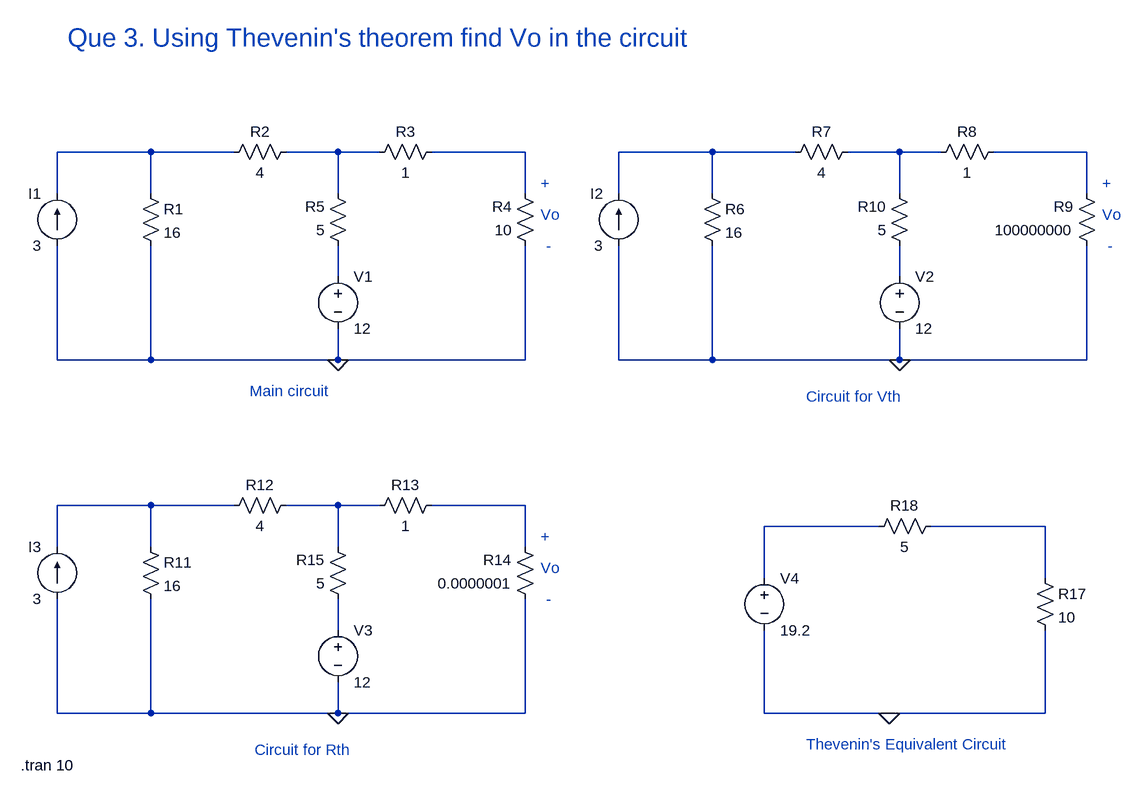
[diagram p0: schematic 3_Dheerendra_23EE019_Thevenins.asc]
3_Dheerendra_23EE019_Thevenins.asc, the LTspice schematic file:
Version 4
SHEET 1 1704 1008
WIRE 208 48 64 48
WIRE 336 48 208 48
WIRE 496 48 416 48
WIRE 560 48 496 48
WIRE 784 48 640 48
WIRE 1072 48 928 48
WIRE 1200 48 1072 48
WIRE 1360 48 1280 48
WIRE 1424 48 1360 48
WIRE 1648 48 1504 48
WIRE 64 112 64 48
WIRE 208 112 208 48
WIRE 496 112 496 48
WIRE 784 112 784 48
WIRE 928 112 928 48
WIRE 1072 112 1072 48
WIRE 1360 112 1360 48
WIRE 1648 112 1648 48
WIRE 496 240 496 192
WIRE 1360 240 1360 192
WIRE 64 368 64 192
WIRE 208 368 208 192
WIRE 208 368 64 368
WIRE 496 368 496 320
WIRE 496 368 208 368
WIRE 784 368 784 192
WIRE 784 368 496 368
WIRE 928 368 928 192
WIRE 1072 368 1072 192
WIRE 1072 368 928 368
WIRE 1360 368 1360 320
WIRE 1360 368 1072 368
WIRE 1648 368 1648 192
WIRE 1648 368 1360 368
WIRE 208 592 64 592
WIRE 336 592 208 592
WIRE 496 592 416 592
WIRE 560 592 496 592
WIRE 784 592 640 592
WIRE 1328 624 1152 624
WIRE 1584 624 1408 624
WIRE 64 656 64 592
WIRE 208 656 208 592
WIRE 496 656 496 592
WIRE 784 656 784 592
WIRE 1152 704 1152 624
WIRE 1584 704 1584 624
WIRE 496 784 496 736
WIRE 64 912 64 736
WIRE 208 912 208 736
WIRE 208 912 64 912
WIRE 496 912 496 864
WIRE 496 912 208 912
WIRE 784 912 784 736
WIRE 784 912 496 912
WIRE 1152 912 1152 784
WIRE 1344 912 1152 912
WIRE 1584 912 1584 784
WIRE 1584 912 1344 912
FLAG 496 368 0
FLAG 1360 368 0
FLAG 496 912 0
FLAG 1344 912 0
SYMBOL current 64 192 R180
WINDOW 0 24 80 Left 2
WINDOW 3 24 0 Left 2
WINDOW 123 0 0 Left 0
WINDOW 39 0 0 Left 0
SYMATTR InstName I1
SYMATTR Value 3
SYMBOL res 192 96 R0
SYMATTR InstName R1
SYMATTR Value 16
SYMBOL res 432 32 R90
WINDOW 0 0 56 VBottom 2
WINDOW 3 32 56 VTop 2
SYMATTR InstName R2
SYMATTR Value 4
SYMBOL res 656 32 R90
WINDOW 0 0 56 VBottom 2
WINDOW 3 32 56 VTop 2
SYMATTR InstName R3
SYMATTR Value 1
SYMBOL res 800 208 R180
WINDOW 0 36 76 Left 2
WINDOW 3 36 40 Left 2
SYMATTR InstName R4
SYMATTR Value 10
SYMBOL res 512 208 R180
WINDOW 0 36 76 Left 2
WINDOW 3 36 40 Left 2
SYMATTR InstName R5
SYMATTR Value 5
SYMBOL voltage 496 224 R0
WINDOW 123 0 0 Left 0
WINDOW 39 0 0 Left 0
SYMATTR InstName V1
SYMATTR Value 12
SYMBOL current 928 192 R180
WINDOW 0 24 80 Left 2
WINDOW 3 24 0 Left 2
WINDOW 123 0 0 Left 0
WINDOW 39 0 0 Left 0
SYMATTR InstName I2
SYMATTR Value 3
SYMBOL res 1056 96 R0
SYMATTR InstName R6
SYMATTR Value 16
SYMBOL res 1296 32 R90
WINDOW 0 0 56 VBottom 2
WINDOW 3 32 56 VTop 2
SYMATTR InstName R7
SYMATTR Value 4
SYMBOL res 1520 32 R90
WINDOW 0 0 56 VBottom 2
WINDOW 3 32 56 VTop 2
SYMATTR InstName R8
SYMATTR Value 1
SYMBOL res 1664 208 R180
WINDOW 0 36 76 Left 2
WINDOW 3 36 40 Left 2
SYMATTR InstName R9
SYMATTR Value 100000000
SYMBOL res 1376 208 R180
WINDOW 0 36 76 Left 2
WINDOW 3 36 40 Left 2
SYMATTR InstName R10
SYMATTR Value 5
SYMBOL voltage 1360 224 R0
WINDOW 123 0 0 Left 0
WINDOW 39 0 0 Left 0
SYMATTR InstName V2
SYMATTR Value 12
SYMBOL current 64 736 R180
WINDOW 0 24 80 Left 2
WINDOW 3 24 0 Left 2
WINDOW 123 0 0 Left 0
WINDOW 39 0 0 Left 0
SYMATTR InstName I3
SYMATTR Value 3
SYMBOL res 192 640 R0
SYMATTR InstName R11
SYMATTR Value 16
SYMBOL res 432 576 R90
WINDOW 0 0 56 VBottom 2
WINDOW 3 32 56 VTop 2
SYMATTR InstName R12
SYMATTR Value 4
SYMBOL res 656 576 R90
WINDOW 0 0 56 VBottom 2
WINDOW 3 32 56 VTop 2
SYMATTR InstName R13
SYMATTR Value 1
SYMBOL res 800 752 R180
WINDOW 0 36 76 Left 2
WINDOW 3 36 40 Left 2
SYMATTR InstName R14
SYMATTR Value 0.0000001
SYMBOL res 512 752 R180
WINDOW 0 36 76 Left 2
WINDOW 3 36 40 Left 2
SYMATTR InstName R15
SYMATTR Value 5
SYMBOL voltage 496 768 R0
WINDOW 123 0 0 Left 0
WINDOW 39 0 0 Left 0
SYMATTR InstName V3
SYMATTR Value 12
SYMBOL res 1568 688 R0
SYMATTR InstName R17
SYMATTR Value 10
SYMBOL res 1424 608 R90
WINDOW 0 0 56 VBottom 2
WINDOW 3 32 56 VTop 2
SYMATTR InstName R18
SYMATTR Value 5
SYMBOL voltage 1152 688 R0
WINDOW 123 0 0 Left 0
WINDOW 39 0 0 Left 0
SYMATTR InstName V4
SYMATTR Value 19.2
TEXT 808 96 Left 2 ;+
TEXT 816 192 Left 2 ;-
TEXT 808 144 Left 2 ;Vo
TEXT 1672 96 Left 2 ;+
TEXT 1680 192 Left 2 ;-
TEXT 1672 144 Left 2 ;Vo
TEXT 808 640 Left 2 ;+
TEXT 816 736 Left 2 ;-
TEXT 808 688 Left 2 ;Vo
TEXT 360 416 Left 2 ;Main circuit
TEXT 1216 424 Left 2 ;Circuit for Vth
TEXT 368 968 Left 2 ;Circuit for Rth
TEXT 1216 960 Left 2 ;Thevenin's Equivalent Circuit
TEXT 80 -128 Left 4 ;Que 3. Using Thevenin's theorem find Vo in the circuit
TEXT 8 992 Left 2 !.tran 10

The netlist it stands for:
* 3_Dheerendra_23EE019_Thevenins.asc
I1 0 N001 3
R1 N001 0 16
R2 N002 N001 4
R3 N003 N002 1
R4 0 N003 10
R5 N007 N002 5
V1 N007 0 12
I2 0 N004 3
R6 N004 0 16
R7 N005 N004 4
R8 N006 N005 1
R9 0 N006 100000000
R10 N008 N005 5
V2 N008 0 12
I3 0 N009 3
R11 N009 0 16
R12 N010 N009 4
R13 N011 N010 1
R14 0 N011 0.0000001
R15 N014 N010 5
V3 N014 0 12
R17 N013 0 10
R18 N013 N012 5
V4 N012 0 19.2
* +
* -
* Vo
* +
* -
* Vo
* +
* -
* Vo
* Main circuit
* Circuit for Vth
* Circuit for Rth
* Thevenin's Equivalent Circuit
* Que 3. Using Thevenin's theorem find Vo in the circuit
.tran 10
.backanno
.end